# EAGLE design revD (EAGLE 9.2.2)

## Sheet 1 of 2
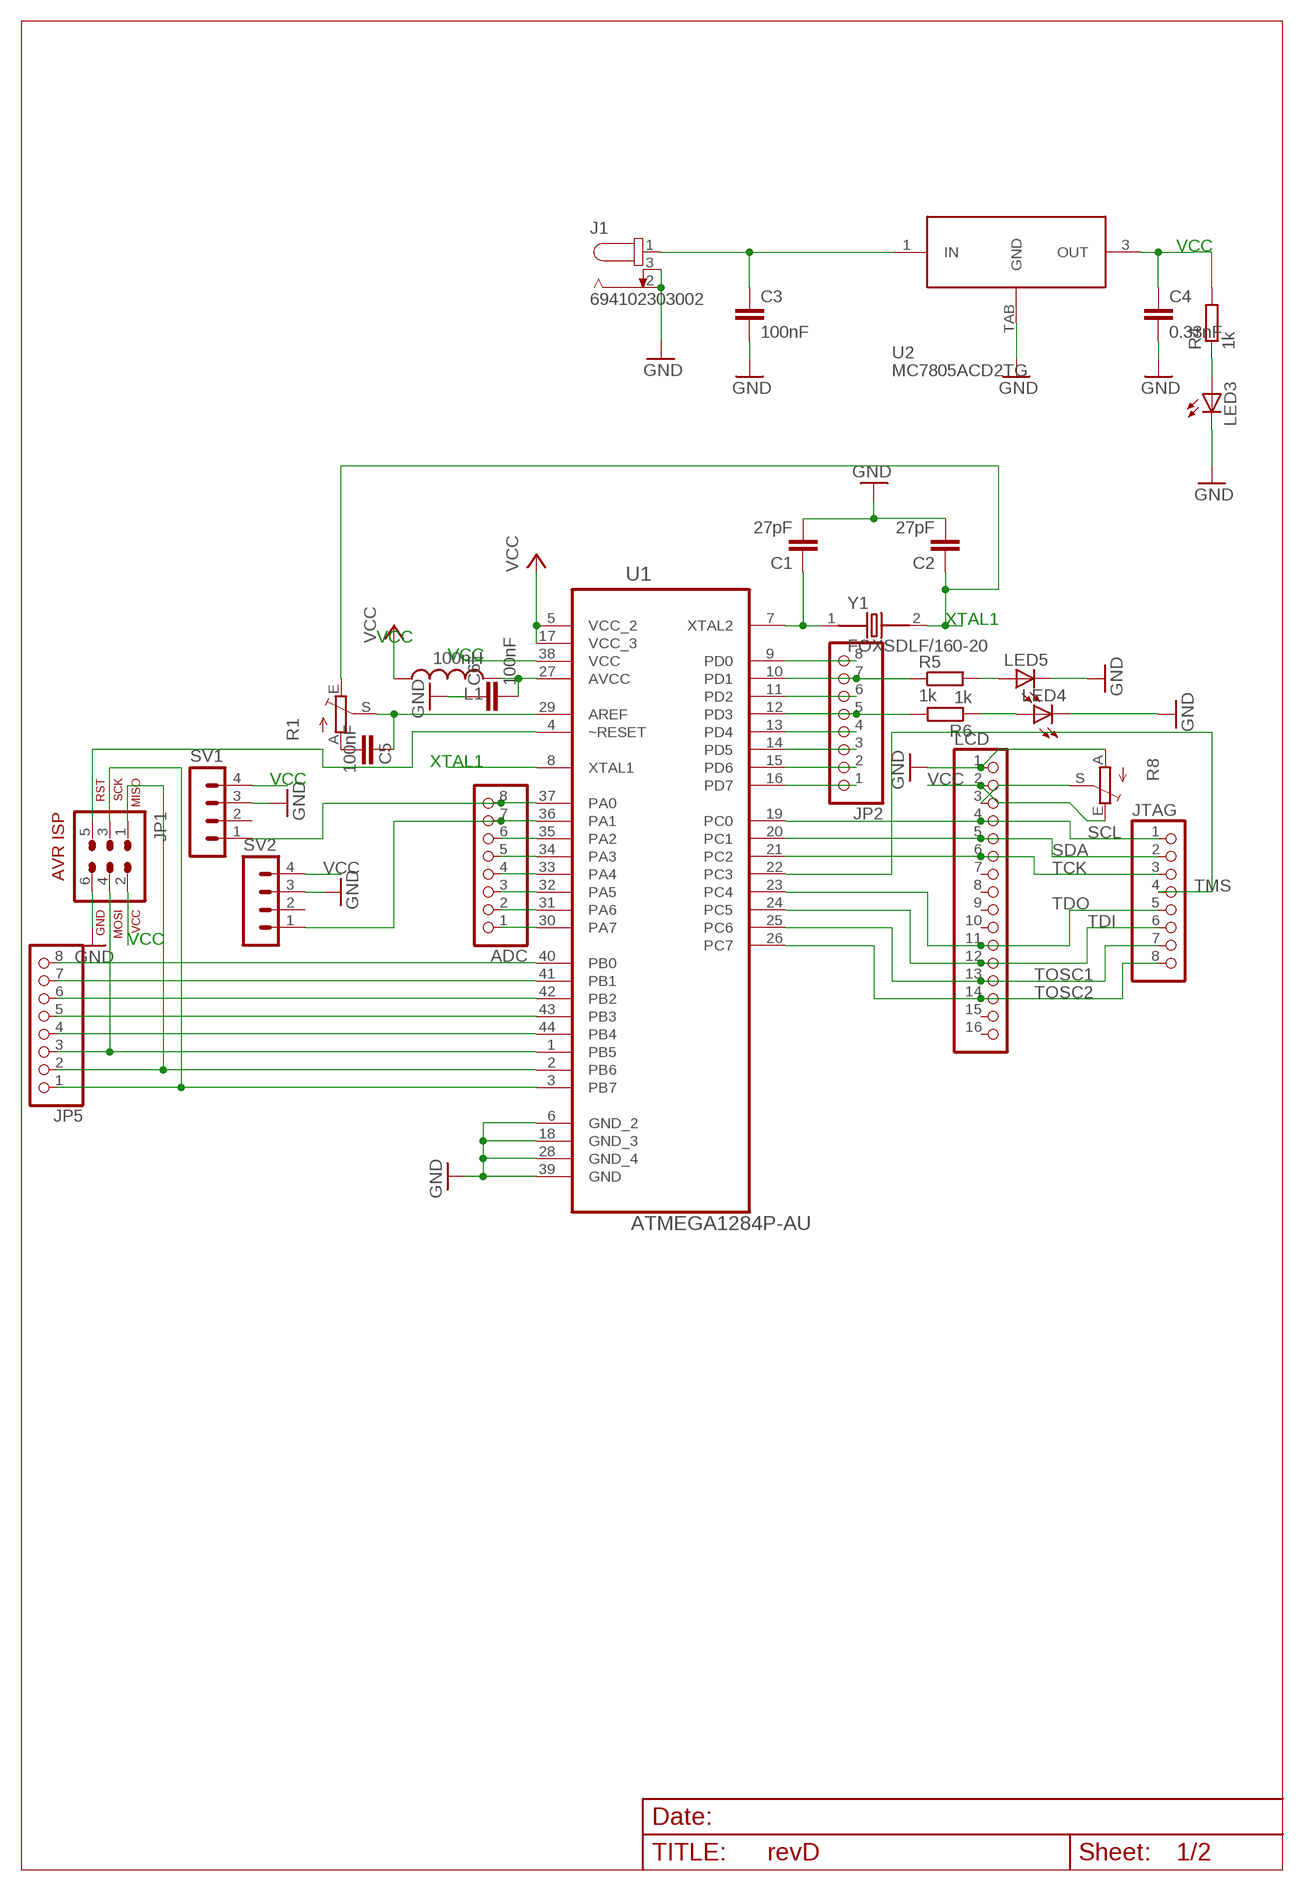
[diagram p0: schematic, sheet 1]

### Parts
ADC  PINHD-1X8  [1X08]
C1  27pF  C-EUC1206  [C1206]
C2  27pF  C-EUC1206  [C1206]
C3  100nF  C-EUC1206  [C1206]
C4  0.33nF  C-EUC1206  [C1206]
C5  100nF  C-EUC1206  [C1206]
C6  100nF  C-EUC1206  [C1206]
J1  694102303002  [69410X303002]
JP1  AVR-ISP-6VERT  [AVR-ISP-6]
JP2  PINHD-1X8  [1X08]
JP5  PINHD-1X8  [1X08]
JTAG  PINHD-1X8  [1X08]
L1  100nH  L-USL1812  [L1812]
LCD  PINHD-1X16  [1X16]
LED3  LED3MM  [LED3MM]
LED4  LED3MM  [LED3MM]
LED5  LED3MM  [LED3MM]
R1  TRIM_1234-S64YW  [S64YW]
R4  1k  R-EU_M1206  [M1206]
R5  1k  R-EU_M1206  [M1206]
R6  1k  R-EU_M1206  [M1206]
R8  TRIM_1234-S64YW  [S64YW]
SV1  MA04-1  [MA04-1]
SV2  MA04-1  [MA04-1]
U1  ATMEGA1284P-AU  [QFP80P1200X1200X120-44N]
U2  MC7805ACD2TG  [D2PAK]
Y1  FOXSDLF/160-20  [XTAL_FOXSDLF/160-20]

### Nets
GND: C1.2 C2.2 C3.2 C4.2 C6.1 J1.2 J1.3 JP1.6 LCD.1 LED3.K(C) LED4.K(C) LED5.K(C) R8.A SV1.3 SV2.3 U1.6(GND_2) U1.18(GND_3) U1.28(GND_4) U1.39(GND) U2.TAB(GND) ; also sheet 2
N$1: C1.1 U1.7(XTAL2) Y1.1
N$2: C5.1 R1.S U1.29(AREF)
N$3: C5.2 R1.A
N$4: C6.2 L1.2 U1.27(AVCC)
N$5: C3.1 J1.1 U2.1(IN)
N$6: LED3.A R4.1
N$7: LED4.A R6.1
N$8: LED5.A R5.2
N$9: LCD.3 R8.S
N$13: JP5.8 U1.40(PB0)
N$14: JP5.7 U1.41(PB1)
N$15: JP5.6 U1.42(PB2)
N$16: JP5.5 U1.43(PB3)
N$17: JP5.4 U1.44(PB4)
N$18: JP1.4 JP5.3 U1.1(PB5)
N$19: JP1.1 JP5.2 U1.2(PB6)
N$20: JP1.3 JP5.1 U1.3(PB7)
N$21: ADC.8 SV1.1 U1.37(PA0)
N$22: ADC.7 SV2.1 U1.36(PA1)
N$23: ADC.6 U1.35(PA2)
N$24: ADC.5 U1.34(PA3)
N$25: ADC.4 U1.33(PA4)
N$26: ADC.3 U1.32(PA5)
N$27: ADC.2 U1.31(PA6)
N$28: ADC.1 U1.30(PA7)
N$29: JP2.8 U1.9(PD0)
N$30: JP2.7 R5.1 U1.10(PD1)
N$31: JP2.6 U1.11(PD2)
N$32: JP2.5 R6.2 U1.12(PD3)
N$33: JP2.4 U1.13(PD4)
N$34: JP2.3 U1.14(PD5)
N$35: JP2.2 U1.15(PD6)
N$36: JP2.1 U1.16(PD7)
N$37: JP1.5 U1.4(~RESET)
SCL: JTAG.1 LCD.4 U1.19(PC0)
SDA: JTAG.2 LCD.5 U1.20(PC1)
TCK: JTAG.3 LCD.6 U1.21(PC2)
TDI: JTAG.6 LCD.12 U1.24(PC5)
TDO: JTAG.5 LCD.11 U1.23(PC4)
TMS: JTAG.4 U1.22(PC3)
TOSC1: JTAG.7 LCD.13 U1.25(PC6)
TOSC2: JTAG.8 LCD.14 U1.26(PC7)
VCC: C4.1 JP1.2 L1.1 LCD.2 R4.2 R8.E SV1.4 SV2.4 U1.5(VCC_2) U1.17(VCC_3) U1.38(VCC) U2.3(OUT) ; also sheet 2
XTAL1: C2.1 R1.E U1.8(XTAL1) Y1.2
Unconnected: LCD.7 LCD.8 LCD.9 LCD.10 LCD.15 LCD.16 R1.S@1(S) R8.S@1(S) SV1.2 SV2.2

## Sheet 2 of 2
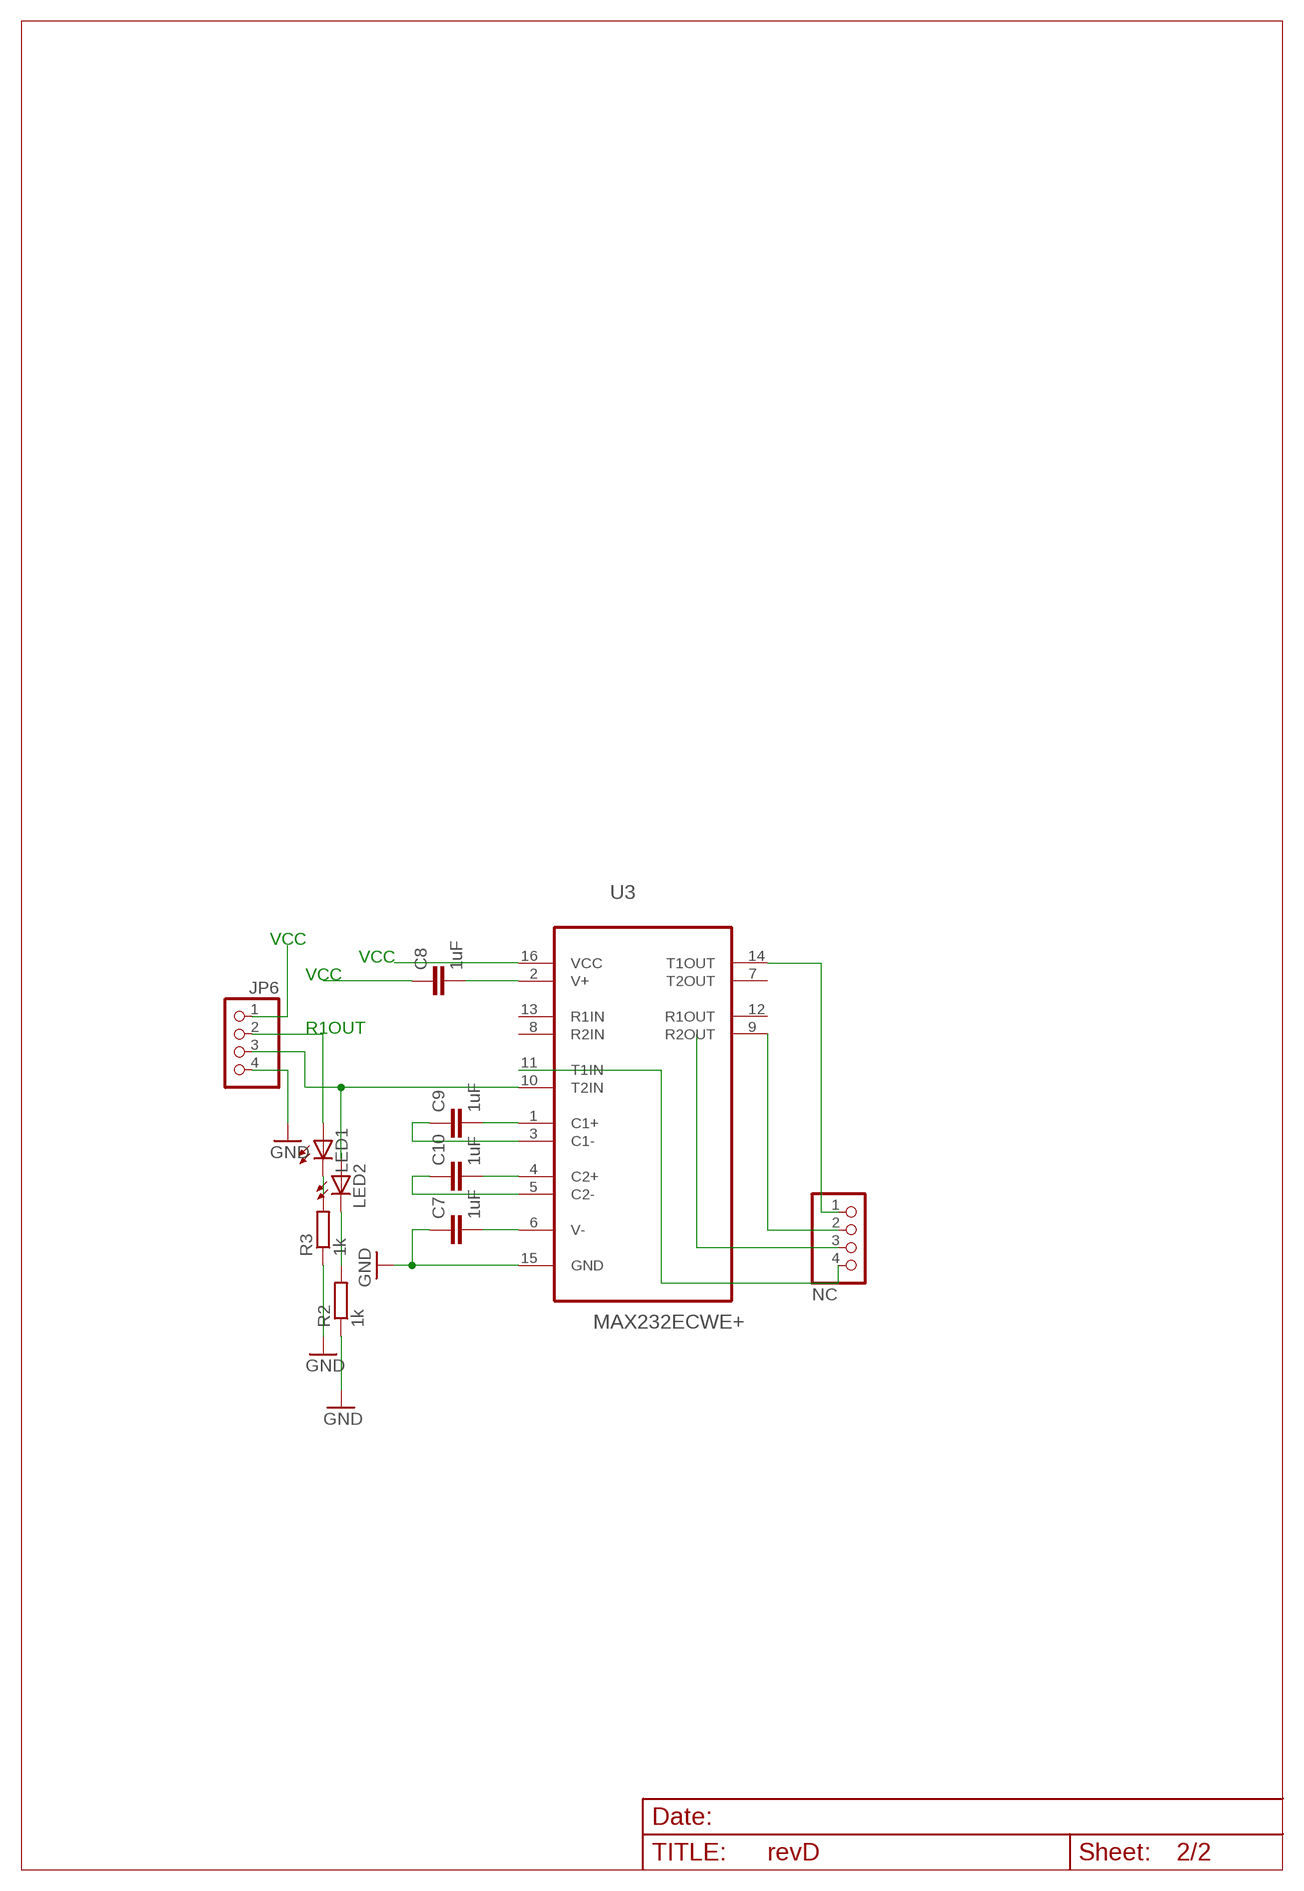
[diagram p1: schematic, sheet 2]

### Parts
C7  1uF  C-EUC1206  [C1206]
C8  1uF  C-EUC1206  [C1206]
C9  1uF  C-EUC1206  [C1206]
C10  1uF  C-EUC1206  [C1206]
JP6  PINHD-1X4  [1X04]
LED1  LEDSMT1206  [1206]
LED2  LEDSMT1206  [1206]
NC  NC  PINHD-1X4  [1X04]
R2  1k  R-EU_R1206  [R1206]
R3  1k  R-EU_R1206  [R1206]
U3  MAX232ECWE+  [SOIC127P1032X265-16N]

### Nets
GND: C7.1 JP6.4 R2.1 R3.1 U3.15(GND) ; also sheet 1
N$38: C8.2 U3.2(V+)
N$39: C7.2 U3.6(V-)
N$40: C10.2 U3.4(C2+)
N$41: C10.1 U3.5(C2-)
N$42: C9.2 U3.1(C1+)
N$43: C9.1 U3.3(C1-)
N$44: JP6.3 LED2.A U3.10(T2IN)
N$45: LED1.C R3.2
N$46: LED2.C R2.2
N$58: NC.1 U3.14(T1OUT)
N$59: NC.2 U3.9(R2OUT)
N$60: NC.4 U3.11(T1IN)
N$61: NC.3
R1OUT: JP6.2 LED1.A
VCC: C8.1 JP6.1 U3.16(VCC) ; also sheet 1
Unconnected: U3.7(T2OUT) U3.8(R2IN) U3.12(R1OUT) U3.13(R1IN)

## Library data of the parts
ADC JP2 JP5 JTAG = pinhead:PINHD-1X8: PIN HEADER
C1-C10 = rcl:C-EU: CAPACITOR, European symbol; SPICEPREFIX: C
J1 = 694102303002:694102303002: WR-DC_DC Power Jack_Right Angled_THT Center Pin Ø1.0_Plug ID Ø1.05_Plug OD Ø3.5 ;=>Code : Con_WR-DC_THT_6941xx303002_694102303002 <http://katalog.we-online.de/media/images/eican/Con_WR-DC_THT_6941xx303002_pf2.jpg> Details see: http://katalog.we-online.de/em/datasheet/6941xx303002.pdf Created 2014-10-08, Karrer Zheng 2014 (C) Wurth Elektronik; AVAILABILITY: Unavailable; DESCRIPTION: DC Power jack [Würth Elektronik] 694102303002 DC Power jack; MF: Wurth Electronics; MP: 694102303002; PACKAGE: None; PRICE: None
JP1 = avr-7:AVR-ISP-6: AVR ISP-6 Serial Programming Header
JP6 NC = pinhead:PINHD-1X4: PIN HEADER
L1 = rcl:L-US: INDUCTOR, American symbol; SPICEPREFIX: L
LCD = pinhead:PINHD-1X16: PIN HEADER
LED1-LED5 = led:LED: LED OSRAM: - CHIPLED LG R971, LG N971, LY N971, LG Q971, LY Q971, LO R971, LY R971 LH N974, LH R974 LS Q976, LO Q976, LY Q976 LO Q996 - Hyper CHIPLED LW Q18S LB Q993, LB Q99A, LB R99A - SideLED LS A670, LO A670, LY A670, LG A670, LP A670 LB A673, LV A673, LT A673, LW A673 LH A674 LY A675 LS A676, LA A676, LO A676, LY A676, LW A676 LS A679, LY A679, LG A679 - Hyper Micro SIDELED® LS Y876, LA Y876, LO Y876, LY Y876 LT Y87S - SmartLED LW L88C, LW L88S LB L89C, LB L89S, LG L890 LS L89K, LO L89K, LY L89K LS L896, LA L896, LO L896, LY L896 - TOPLED LS T670, LO T670, LY T670, LG T670, LP T670 LSG T670, LSP T670, LSY T670, LOP T670, LYG T670 LG T671, LOG T671, LSG T671 LB T673, LV T673, LT T673, LW T673 LH T674 LS T676, LA T676, LO T676, LY T676, LB T676, LH T676, LSB T676, LW T676 LB T67C, LV T67C, LT T67C, LS T67K, LO T67K, LY T67K, LW E67C LS E67B, LA E67B, LO E67B, LY E67B, LB E67C, LV E67C, LT E67C LW T67C LS T679, LY T679, LG T679 LS T770, LO T770, LY T770, LG T770, LP T770 LB T773, LV T773, LT T773, LW T773 LH T774 LS E675, LA E675, LY E675, LS T675 LS T776, LA T776, LO T776, LY T776, LB T776 LHGB T686 LT T68C, LB T68C - Hyper Mini TOPLED® LB M676 - Mini TOPLED Santana® LG M470 LS M47K, LO M47K, LY M47K Source: http://www.osram.convergy.de LUXEON: - LUMILED® LXK2-PW12-R00, LXK2-PW12-S00, LXK2-PW14-U00, LXK2-PW14-V00 LXK2-PM12-R00, LXK2-PM12-S00, LXK2-PM14-U00 LXK2-PE12-Q00, LXK2-PE12-R00, LXK2-PE12-S00, LXK2-PE14-T00, LXK2-PE14-U00 LXK2-PB12-K00, LXK2-PB12-L00, LXK2-PB12-M00, LXK2-PB14-N00, LXK2-PB14-P00, LXK2-PB14-Q00 LXK2-PR12-L00, LXK2-PR12-M00, LXK2-PR14-Q00, LXK2-PR14-R00 LXK2-PD12-Q00, LXK2-PD12-R00, LXK2-PD12-S00 LXK2-PH12-R00, LXK2-PH12-S00 LXK2-PL12-P00, LXK2-PL12-Q00, LXK2-PL12-R00 Source: www.luxeon.com KINGBRIGHT: KA-3528ASYC Source: www.kingbright.com
R1 R8 = pot:TRIM_1234-: POTENTIOMETER
R2-R6 = rcl:R-EU_: RESISTOR, European symbol; SPICEPREFIX: R
SV1 SV2 = con-lstb:MA04-1: PIN HEADER; OC_FARNELL: unknown; OC_NEWARK: unknown
U1 = ATMEGA1284P-AU:ATMEGA1284P-AU: Microcontroller with Programmable Flash; AVAILABILITY: Unavailable; DESCRIPTION: MCU 8-Bit ATmega AVR RISC 128KB Flash 2.5V/3.3V/5V 44-Pin TQFP; MF: Microchip; MP: ATMEGA1284P-AU; PACKAGE: TQFP-44 Microchip; PRICE: None
U2 = MC7805ACD2TG:MC7805ACD2TG: http://octopart.com/mc7805acd2tg.-on+semiconductor-11809125; AVAILABILITY: Unavailable; DESCRIPTION: Linear Voltage Regulator, Positive, 5.0 V, 1.0 A Vout: 5.0 V; TJ = 0°C to +125°C; MF: ON Semiconductor; MP: MC7805ACD2TG; PACKAGE: D2PAK ON Semiconductor; PRICE: None
U3 = MAX232ECWE_:MAX232ECWE+: +5V-Powered, Multichannel RS-232 Drivers/Receivers; AVAILABILITY: Unavailable; DESCRIPTION: Dual Transmitter/Receiver RS-232 16-Pin SOIC W; MF: Maxim Integrated; MP: MAX232ECWE+; PACKAGE: SOIC-16 Maxim Integrated; PRICE: None
Y1 = FOXSDLF_160-20:FOXSDLF/160-20: Crystal 16MHz 20pF 2-Pin HC-49/SD; AVAILABILITY: Unavailable; DESCRIPTION: Crystal 16MHz 20pF 2-Pin HC-49/SD; MF: Fox; MP: FOXSDLF/160-20; PACKAGE: HC49/US Fox; PRICE: None

## Board
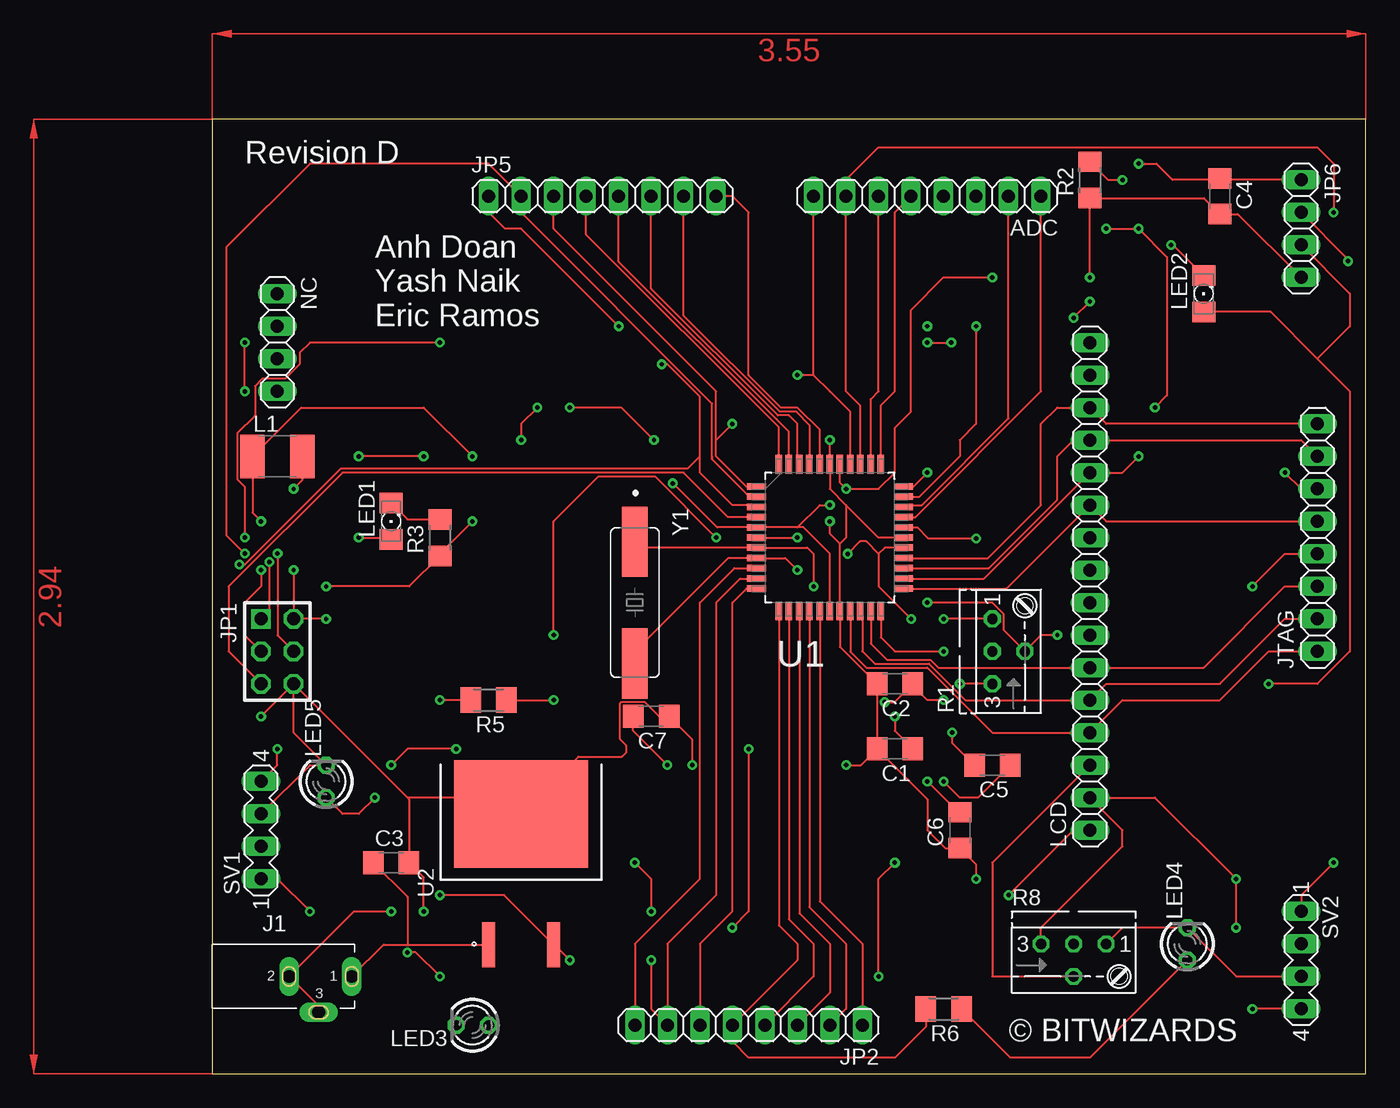
[diagram p2: board, top side]
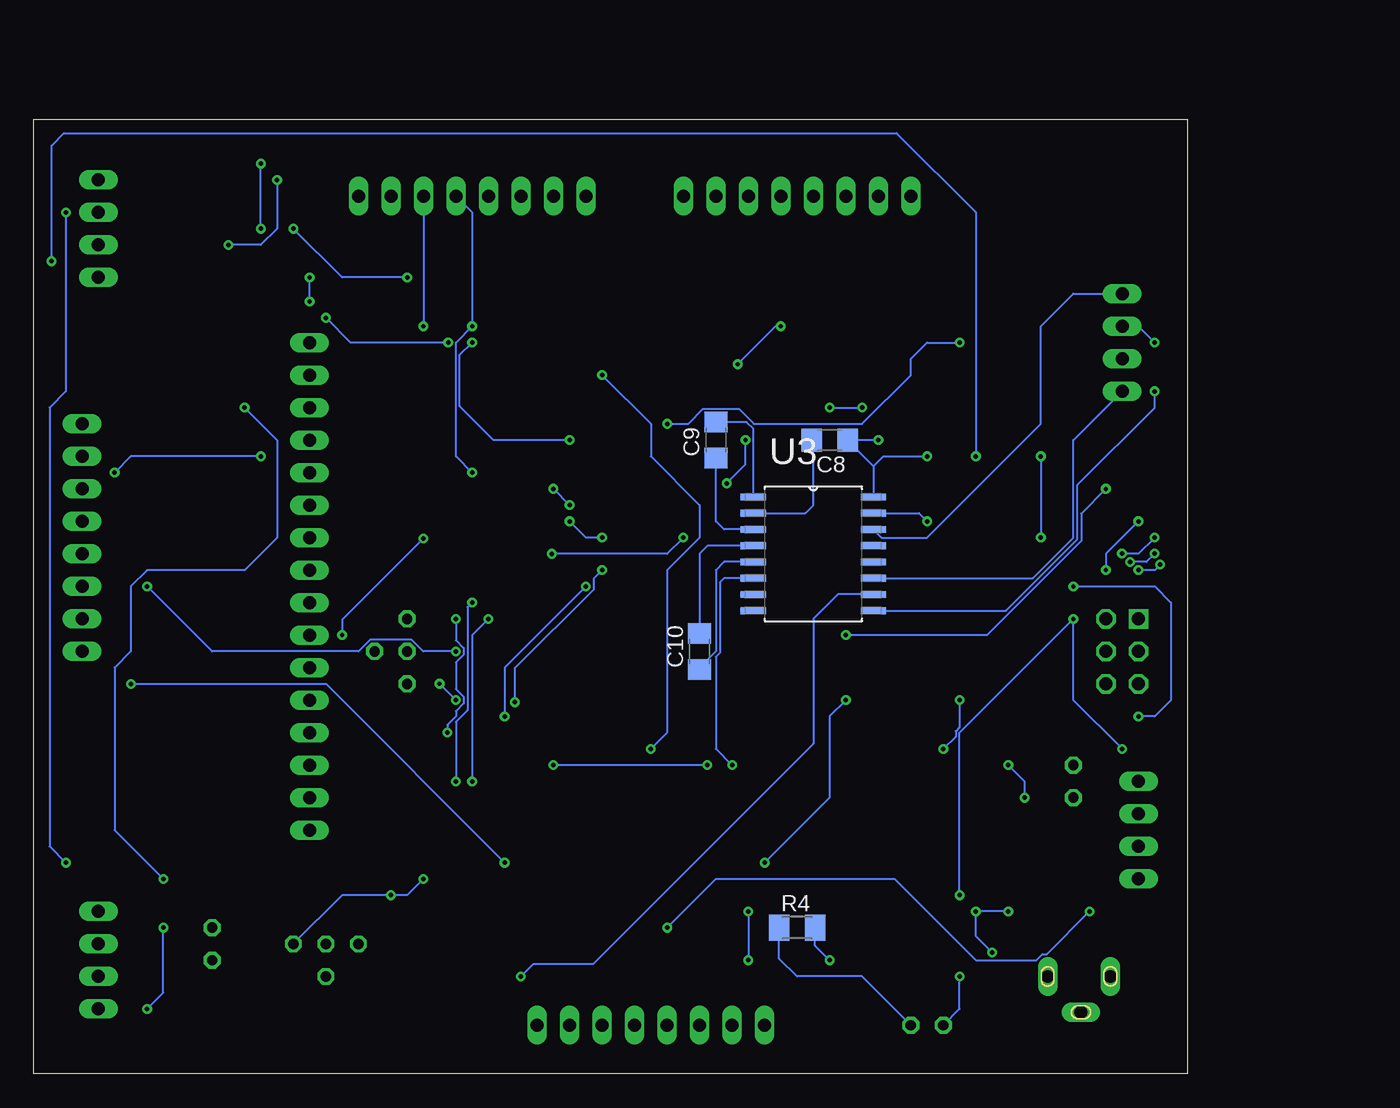
[diagram p3: board, bottom side, seen from below]

Size 90.15 x 74.6 mm. Coordinates in mm from the lower left corner, seen from the top.
Outline: 0,0 90.15,0 90.15,74.6 0,74.6 0,0
Copper layers (1*16): Top 0.035mm / dielectric 1.5mm / Bottom 0.035mm
Design rules "default": minimum track width 6mil, minimum drill 0.35mm, track to track 6mil, track to pad 6mil, pad to pad 6mil, via to via 6mil, smd to smd 6mil, copper to edge 40mil, drill to drill 6mil, minimum pad ring 10mil, minimum via ring 8mil, stop-mask expansion 4mil, vias tented up to drill 0mil, thermal gap 10mil

### Footprints (pad centres in the part's own frame; a part is rotated, then mirrored left to right if it is on the bottom)
1X08 = drill 1.016 long: 1 -8.89,0; 2 -6.35,0; 3 -3.81,0; 4 -1.27,0; 5 1.27,0; 6 3.81,0; 7 6.35,0; 8 8.89,0
C1206 = smd 1.6 x 1.8: 1 -1.4,0; 2 1.4,0
69410X303002 = drill 1 pad 1.5 long: 1 10.9,0; 2 6,0; 3 8.3,-2.8
AVR-ISP-6 = drill 1.016 square: 1 -2.54,-1.27 | drill 1.016 octagon: 2 -2.54,1.27; 3 0,-1.27; 4 0,1.27; 5 2.54,-1.27; 6 2.54,1.27
1X04 = drill 1.016 long: 1 -3.81,0; 2 -1.27,0; 3 1.27,0; 4 3.81,0
L1812 = smd 1.9 x 3.4: 1 -1.95,0; 2 1.95,0
1X16 = drill 1.016 long: 1 -19.05,0; 2 -16.51,0; 3 -13.97,0; 4 -11.43,0; 5 -8.89,0; 6 -6.35,0; 7 -3.81,0; 8 -1.27,0; 9 1.27,0; 10 3.81,0; 11 6.35,0; 12 8.89,0; 13 11.43,0; 14 13.97,0; 15 16.51,0; 16 19.05,0
1206 = smd 1.6 x 1.803: A -1.422,0; C 1.422,0
LED3MM = drill 0.813 octagon: A -1.27,0; K 1.27,0
S64YW = drill 0.813 octagon: A 2.54,1.27; E -2.54,1.27; S 0,-1.27; S@1 0,1.27
R1206 = smd 1.6 x 1.803: 1 -1.422,0; 2 1.422,0
M1206 = smd 1.6 x 2: 1 -1.4,0; 2 1.4,0
MA04-1 = drill 1.016 long: 1 -3.81,0; 2 -1.27,0; 3 1.27,0; 4 3.81,0
QFP80P1200X1200X120-44N = smd 1.473 x 0.508: 1 -5.74,3.988; 2 -5.74,3.2; 3 -5.74,2.388; 4 -5.74,1.6; 5 -5.74,0.787; 6 -5.74,0; 7 -5.74,-0.787; 8 -5.74,-1.6; 9 -5.74,-2.388; 10 -5.74,-3.2; 11 -5.74,-3.988; 23 5.74,-3.988; 24 5.74,-3.2; 25 5.74,-2.388; 26 5.74,-1.6; 27 5.74,-0.787; 28 5.74,0; 29 5.74,0.787; 30 5.74,1.6; 31 5.74,2.388; 32 5.74,3.2; 33 5.74,3.988 | smd 0.508 x 1.473: 12 -3.988,-5.74; 13 -3.2,-5.74; 14 -2.388,-5.74; 15 -1.6,-5.74; 16 -0.787,-5.74; 17 0,-5.74; 18 0.787,-5.74; 19 1.6,-5.74; 20 2.388,-5.74; 21 3.2,-5.74; 22 3.988,-5.74; 34 3.988,5.74; 35 3.2,5.74; 36 2.388,5.74; 37 1.6,5.74; 38 0.787,5.74; 39 0,5.74; 40 -0.787,5.74; 41 -1.6,5.74; 42 -2.388,5.74; 43 -3.2,5.74; 44 -3.988,5.74
D2PAK = smd 3.504 x 1.016: 1 -3.863,2.54; 3 -3.863,-2.54 | smd 8.38 x 10.49: TAB 6.35,0
SOIC127P1032X265-16N = smd 1.981 x 0.533: 1 -4.699,4.445; 2 -4.699,3.175; 3 -4.699,1.905; 4 -4.699,0.635; 5 -4.699,-0.635; 6 -4.699,-1.905; 7 -4.699,-3.175; 8 -4.699,-4.445; 9 4.699,-4.445; 10 4.699,-3.175; 11 4.699,-1.905; 12 4.699,-0.635; 13 4.699,0.635; 14 4.699,1.905; 15 4.699,3.175; 16 4.699,4.445
XTAL_FOXSDLF/160-20 = smd 5.5 x 2: 1 -4.75,0; 2 4.75,0

### Placement (x,y rotation side)
ADC  55.88,68.58 180 top
C1  53.34,25.4 180 top
C2  53.34,30.48 180 top
C3  13.97,16.51 0 top
C4  78.74,68.58 270 top
C5  60.96,24.13 180 top
C6  58.42,19.05 90 top
C7  34.29,27.94 180 top
C8  27.94,49.53 180 bottom
C9  36.83,49.53 90 bottom
C10  38.1,33.02 90 bottom
J1  0,7.62 0 top
JP1  5.08,33.02 270 top
JP2  41.91,3.81 180 top
JP5  30.48,68.58 0 top
JP6  85.09,66.04 270 top
JTAG  86.36,41.91 90 top
L1  5.08,48.26 0 top
LCD  68.58,38.1 90 top
LED1  13.97,43.18 90 top
LED2  77.47,60.96 90 top
LED3  20.32,3.81 180 top
LED4  76.2,10.16 90 top
LED5  8.89,22.86 90 top
NC  5.08,57.15 270 top
R1  62.23,33.02 90 top
R2  68.58,69.85 90 top
R3  17.78,41.91 90 top
R4  30.48,11.43 0 bottom
R5  21.59,29.21 180 top
R6  57.15,5.08 180 top
R8  67.31,8.89 0 top
SV1  3.81,19.05 90 top
SV2  85.09,8.89 270 top
U1  48.26,41.91 0 top
U2  24.13,13.97 90 top
U3  29.21,40.64 0 bottom
Y1  33.02,36.83 270 top

### Tracks (layer width: path | path; a pad name or v marks a point on that pad's centre or on a via)
GND  (via drill 0.35)
  Top 0.152: 49.05,41.43 U1.18 49.05,33.37 C2.2 C1.2 | 49.53,44.45 48.26,45.72 U1.39 v48.26,49.53 | U1.6 v45.72,41.91 | J1.3 8.3,5.32 J1.2 11.08,12.7 v13.97,12.7 | v16.51,12.7 16.51,15.37 C3.2 15.37,21.46 15.24,21.59 | JP1.6 15.24,21.59 | 15.24,21.59 22.86,21.59 U2.TAB 28.6,24.79 32,24.79 32.36,25.15 32.36,25.65 31.86,26.15 31.86,28.93 32,29.07 33.78,29.07 34.91,27.94 C7.1 37.49,26.14 v37.49,24.13 | v20.32,43.18 17.78,40.64 R3.1 15.39,38.1 v8.89,38.1 | v59.69,15.24 59.69,16.38 C6.1 57.28,17.65 55.88,19.05 55.88,21.46 C1.2 | JP6.4 80.14,67.18 C4.2 77.49,68.43 R2.1 v68.58,62.23 | v3.81,27.94 JP1.6 | v49.53,24.13 50.67,24.13 C1.2 | v55.88,57.15 v57.76,57.15 | v67.31,59.08 v68.58,60.35 | 49.05,41.43 48.26,42.22 v48.26,43.18 | 49.05,41.43 49.53,41.91 49.53,44.45 | U1.28 52.07,41.91 49.53,44.45 | SV2.3 80.01,7.62 LED4.K 71.12,11.43 R8.A | v17.78,7.62 15.9,9.5 v15.24,9.5 | JP1.6 6.35,26.67 LED5.K 7.62,24.13 SV1.3 | v62.23,13.97 67.31,19.05 LCD.1
  Bottom 0.152: v45.72,41.91 46.99,41.91 v48.26,43.18 | v13.97,12.7 v16.51,12.7 16.51,10.77 v15.24,9.5 | U3.15 20.95,43.81 v20.32,43.18 | v59.69,15.24 60.96,13.97 v62.23,13.97 66.04,13.97 R8.A | v8.89,38.1 2.54,38.1 1.27,36.83 1.27,29.21 2.54,27.94 v3.81,27.94 | v37.49,24.13 v49.53,24.13 | v48.26,49.53 54.2,49.53 56.84,52.18 56.84,56.19 v55.88,57.15 | v57.76,57.15 65.38,57.15 v67.31,59.08 | v68.58,60.35 v68.58,62.23 | LED3.K 17.78,5.08 v17.78,7.62
N$1  (via drill 0.35)
  Top 0.152: Y1.1 33.48,41.12 U1.7 46.51,41.12 46.99,40.64 v46.99,38.1 | v53.34,27.94 53.34,26.8 C1.1
  Bottom 0.152: v46.99,38.1 53.34,31.75 v53.34,27.94
N$2  (via drill 0.35)
  Top 0.152: U1.29 55.09,42.7 55.94,41.85 v59.69,41.85 | v66.04,34.29 64.77,34.29 R1.S 61.85,34.67 61.85,35.93 60.95,36.83 v55.88,36.83 | v57.15,22.86 58.42,21.59 59.69,21.59 59.82,21.59 C5.1
  Bottom 0.152: v59.69,41.85 66.04,35.5 v66.04,34.29 | v57.15,22.86 57.15,27.51 56.24,28.42 56.24,36.47 v55.88,36.83
N$3  (via drill 0.35)
  Top 0.152: R1.A v57.15,35.56 | v57.81,26.67 57.81,25.88 C5.2
  Bottom 0.152: v57.15,35.56 57.15,33.88 56.54,33.27 56.54,32.77 57.15,32.16 57.15,30.07 56.54,29.46 56.54,28.96 57.15,28.35 57.15,27.94 57.81,27.28 v57.81,26.67
N$4  (via drill 0.35)
  Top 0.152: v54.61,35.56 52.07,38.1 52.07,40.64 | v55.88,22.86 58.29,20.45 C6.2 | L1.2 7.03,46.4 v6.35,45.72 | v26.67,34.29 26.67,43.18 30.18,46.69 34.59,46.69 v39.37,41.91 | U1.27 52.55,41.12 52.07,40.64 | 52.07,40.64 51.1,41.6 50.62,41.6 v49.65,40.64
  Bottom 0.152: v54.61,35.56 55.88,34.29 v55.88,22.86 | v6.35,45.72 8.28,43.79 8.28,41.66 15.65,34.29 v26.67,34.29 | v39.37,41.91 40.64,40.64 v49.65,40.64
N$5
  Top 0.152: J1.1 13.39,10.11 15.24,10.11 | 15.24,10.11 U2.1 | C3.1 15.24,13.84 15.24,10.11
N$6
  Bottom 0.152: LED3.A 25.4,7.62 30.48,7.62 31.88,9.02 R4.1
N$7
  Top 0.152: LED4.A 68.58,1.27 62.36,1.27 R6.1
N$8  (via drill 0.35)
  Top 0.152: R5.2 v17.78,29.21 | v19.05,25.4 15.24,25.4 v13.97,24.13 | v12.7,21.59 11.43,20.32 10.16,20.32 LED5.A
  Bottom 0.152: v17.78,29.21 17.78,27.1 18.09,26.8 18.09,26.36 v19.05,25.4 | v13.97,24.13 12.7,22.86 v12.7,21.59
N$9
  Top 0.152: LCD.3 60.96,16.51 60.96,7.62 R8.S
N$13
  Top 0.152: U1.40 47.47,50.32 45.72,52.07 44.45,52.07 41.91,54.61 41.91,67.31 40.64,68.58 JP5.8
N$14
  Top 0.152: JP5.7 36.83,59.26 44.32,51.77 45.59,51.77 46.66,50.7 U1.41
N$15
  Top 0.152: U1.42 45.72,47.8 45.72,50.8 45.06,51.46 44.2,51.46 34.29,61.37 JP5.6
N$16
  Top 0.152: U1.43 45.06,50.19 44.09,51.16 44.07,51.16 31.75,63.48 JP5.5
N$17
  Top 0.152: U1.44 44.27,50.52 29.21,65.59 JP5.4
N$18  (via drill 0.35)
  Top 0.152: U1.1 41.73,45.9 39.37,48.26 | 39.37,48.26 39.37,53.34 26.67,66.04 JP5.3 | 39.37,48.26 39.37,49.53 v40.64,50.8 | v17.78,57.15 7.62,57.15 6.83,56.36 6.83,55.47 5.69,54.33 3.91,54.33 3.33,53.75 3.33,51.43 1.95,50.05 1.95,46.47 2.54,45.88 v2.54,41.91 | v5.09,40.66 5.09,34.27 JP1.4
  Bottom 0.152: v40.64,50.8 38.98,50.8 37.83,51.96 35.02,51.96 33.86,50.8 25.4,50.8 21.59,54.61 21.59,55.88 20.32,57.15 v17.78,57.15 | v2.54,41.91 3.79,40.66 v5.09,40.66
N$19  (via drill 0.35)
  Top 0.152: 39.06,48.04 39.06,48.26 | 39.06,48.26 39.06,52.38 24.13,67.31 JP5.2 21.59,71.12 7.62,71.12 1.09,64.59 1.09,42.1 v2.54,40.66 | v4.45,40.01 4.45,36.2 JP1.1 | 39.06,48.26 39.06,48.04 | 39.06,48.04 41.99,45.11 U1.2
  Bottom 0.152: v2.54,40.66 3.18,40.01 v4.45,40.01
N$20  (via drill 0.35)
  Top 0.152: 38.1,48.26 38.1,52.91 35.56,55.45 v35.13,55.45 | v31.75,58.42 24.13,66.04 22.86,66.04 21.59,67.31 JP5.1 | 38.1,48.26 37.13,47.3 10.03,47.3 2.54,39.8 v2.11,39.8 | v3.81,39.37 3.81,38.1 2.54,36.83 2.54,34.29 JP1.3 | U1.3 42.37,44.45 40.64,44.45 38.1,46.99 38.1,48.26
  Bottom 0.152: v35.13,55.45 32.16,58.42 v31.75,58.42 | v2.11,39.8 2.54,39.37 v3.81,39.37
N$21  (via drill 0.35)
  Top 0.152: U1.37 49.86,51.74 48.26,53.34 46.99,54.61 | 46.99,54.61 ADC.8 | 46.99,54.61 v45.72,54.61 | v41.91,25.4 41.91,12.7 v40.64,11.43 | v7.62,12.7 5.08,15.24 SV1.1
  Bottom 0.152: v45.72,54.61 41.91,50.8 41.91,48.26 38.1,44.45 38.1,41.91 40.64,39.37 40.64,26.67 v41.91,25.4 | v40.64,11.43 36.83,15.24 22.86,15.24 16.51,8.89 11.77,8.89 11.31,9.36 10.96,9.36 v7.62,12.7
N$22  (via drill 0.35)
  Top 0.152: U1.36 50.65,52.22 49.53,53.34 ADC.7 49.53,69.85 52.07,72.39 86.36,72.39 87.63,71.12 v87.63,67.31 | v87.63,16.51 85.09,13.97 SV2.1
  Bottom 0.152: v87.63,67.31 87.63,53.34 88.9,52.07 88.9,17.78 v87.63,16.51
N$23
  Top 0.152: U1.35 51.46,52.73 52.07,53.34 ADC.6
N$24
  Top 0.152: U1.34 52.25,52.25 53.34,53.34 53.34,67.31 ADC.5
N$25  (via drill 0.35)
  Top 0.152: U1.33 54.79,45.9 v55.88,46.99
  Bottom 0.152: v55.88,46.99 57.15,48.26 57.15,57.15 v55.88,58.42 55.88,67.31 ADC.4
N$26  (via drill 0.35)
  Top 0.152: U1.32 55.27,45.11 58.42,48.26 58.42,49.53 59.69,50.8 v59.69,58.42
  Bottom 0.152: ADC.3 v59.69,58.42
N$27
  Top 0.152: U1.31 54.15,44.45 55.45,44.45 62.23,51.23 ADC.2
N$28
  Top 0.152: U1.30 54.94,43.51 64.77,53.34 ADC.1
N$29
  Top 0.152: JP2.8 33.02,10.16 38.1,15.24 38.1,36.83 40.79,39.52 U1.9
N$30  (via drill 0.35)
  Top 0.152: U1.10 41.25,38.71 39.37,36.83 39.37,13.97 35.56,10.16 JP2.7 34.29,5.08 v34.29,8.89 | R5.1 v26.67,29.21 | v33.02,16.51 34.29,15.24 v34.29,12.7
  Bottom 0.152: v26.67,29.21 27.94,27.94 27.94,21.59 v33.02,16.51 | v34.29,12.7 v34.29,8.89
N$31
  Top 0.152: JP2.6 38.1,10.16 40.64,12.7 40.64,36.83 41.73,37.92 U1.11
N$32
  Top 0.152: U1.12 44.27,11.61 45.72,10.16 45.72,8.89 JP2.5 40.64,2.54 41.91,1.27 53.34,1.27 55.75,3.68 R6.2
N$33
  Top 0.152: U1.13 45.06,12.09 46.99,10.16 46.99,7.62 JP2.4
N$34
  Top 0.152: U1.14 45.87,12.55 48.26,10.16 48.26,6.35 JP2.3
N$35
  Top 0.152: U1.15 46.66,13.03 49.53,10.16 49.53,5.08 JP2.2
N$36
  Top 0.152: U1.16 47.47,13.49 50.8,10.16 JP2.1
N$37
  Top 0.152: JP1.5 1.27,33.02 1.27,38.1 10.16,46.99 36.83,46.99 40.31,43.51 U1.4
N$38
  Bottom 0.152: U3.2 29.84,43.81 29.21,44.45 29.21,49.53 C8.2
N$39  (via drill 0.35)
  Top 0.152: v35.56,24.13 32.89,26.8 C7.2
  Bottom 0.152: U3.6 36.2,38.73 36.52,38.41 36.52,32.89 36.83,32.59 36.83,25.4 v35.56,24.13
N$40
  Bottom 0.152: U3.4 37.47,41.27 38.1,40.64 C10.2
N$41
  Bottom 0.152: U3.5 36.2,40.01 36.83,39.37 36.83,33.02 38.1,31.75 C10.1
N$42
  Bottom 0.152: U3.1 33.91,50.42 34.42,50.93 C9.2
N$43
  Bottom 0.152: U3.3 36.2,42.55 36.83,43.18 C9.1
N$44  (via drill 0.35)
  Top 0.152: v52.07,7.62 52.07,15.24 v53.34,16.51 | LED2.A 82.7,59.54 86.36,55.88 | 86.36,55.88 88.9,53.34 88.9,33.02 86.36,30.48 v82.55,30.48 | JP6.3 88.9,60.96 88.9,58.42 86.36,55.88
  Bottom 0.152: U3.10 27.3,37.47 29.21,35.56 29.21,25.81 46.43,8.59 51.1,8.59 v52.07,7.62 | v53.34,16.51 67.31,30.48 v82.55,30.48
N$45
  Top 0.152: LED1.C 15.24,43.33 R3.2
N$46  (via drill 0.35)
  Top 0.152: R2.2 70,69.85 v71.12,69.85 | v74.93,64.77 75.08,64.77 LED2.C
  Bottom 0.152: v71.12,69.85 71.12,66.04 72.39,64.77 v74.93,64.77
N$58
  Bottom 0.152: NC.1 8.89,60.96 11.43,58.42 11.43,50.8 20.32,41.91 23.88,41.91 U3.14
N$59  (via drill 0.35)
  Top 0.152: v2.54,53.34 v2.54,57.15
  Bottom 0.152: U3.9 14.17,36.2 8.59,41.78 8.59,46.02 2.54,52.07 v2.54,53.34 | v2.54,57.15 3.81,58.42 NC.2
N$60
  Bottom 0.152: U3.11 12.06,38.73 8.89,41.91 8.89,49.53 NC.4
R1OUT  (via drill 0.35)
  Top 0.152: JP6.2 88.76,63.64 v88.76,63.5 | v16.51,48.26 v11.43,48.26 | v11.43,41.91 13.82,41.91 LED1.A
  Bottom 0.152: v88.76,63.5 88.76,72.53 87.78,73.51 22.71,73.51 16.51,67.31 v16.51,48.26 | v11.43,48.26 v11.43,41.91
SCL
  Top 0.152: U1.19 49.86,32.99 51.1,31.75 55.88,31.75 60.96,26.67 LCD.4 71.12,29.21 78.74,29.21 82.55,33.02 JTAG.1
SDA
  Top 0.152: U1.20 50.8,36.02 50.8,33.02 51.77,32.05 56.01,32.05 58.85,29.21 LCD.5 69.85,30.48 78.74,30.48 83.82,35.56 JTAG.2
TCK
  Top 0.152: U1.21 51.46,33.63 52.73,32.36 56.13,32.36 56.74,31.75 LCD.6 77.47,31.75 83.82,38.1 JTAG.3
TDI  (via drill 0.35)
  Top 0.152: U1.24 60.3,38.71 LCD.12 71.12,46.99 v72.39,48.26 | v83.82,46.99 85.09,45.72 JTAG.6
  Bottom 0.152: v72.39,48.26 82.55,48.26 v83.82,46.99
TDO
  Top 0.152: U1.23 62.05,37.92 LCD.11 69.85,43.18 JTAG.5
TMS  (via drill 0.35)
  Top 0.152: U1.22 52.25,34.11 53.34,33.02 v57.15,33.02 | v81.28,38.1 83.82,40.64 JTAG.4
  Bottom 0.152: v81.28,38.1 76.2,33.02 64.76,33.02 63.87,33.91 60.59,33.91 59.7,33.02 v57.15,33.02
TOSC1
  Top 0.152: U1.25 60.68,39.52 66.04,44.88 66.04,48.26 67.31,49.53 LCD.13 85.09,49.53 JTAG.7
TOSC2
  Top 0.152: U1.26 60.63,40.31 64.77,44.45 64.77,50.8 66.04,52.07 LCD.14 69.85,50.8 JTAG.8
VCC  (via drill 0.35)
  Top 0.152: U1.17 48.26,40.64 46.2,42.7 45.72,42.7 | 45.72,42.7 U1.5 39.44,42.7 v35.99,46.15 | v17.78,13.97 22.81,13.97 U2.3 26.72,10.11 v27.94,8.89 | v8.89,35.56 JP1.2 v6.35,39.37 | v3.81,43.18 3.13,43.86 L1.1 6.94,52.07 16.51,52.07 v20.32,48.26 | JP6.1 75.06,69.85 75,69.92 | C4.1 78.67,69.92 75,69.92 | v72.39,71.12 73.79,71.12 75,69.92 | v34.52,49.53 31.98,52.07 v27.94,52.07 | v25.4,52.07 24.13,50.8 v24.13,49.53 | 45.72,42.7 47.47,44.45 v48.26,44.45 | U1.38 49.05,46.2 v49.53,45.72 52.07,45.72 53.34,46.99 53.34,50.48 54.61,51.75 54.61,59.69 57.15,62.23 v60.96,62.23 | v69.85,66.04 v72.39,66.04 74.61,63.82 74.61,53.02 v73.66,52.07 | SV2.4 v81.28,5.08 | v80.01,11.43 v80.01,15.24 73.66,21.59 LCD.2 71.12,19.05 71.12,17.78 64.77,11.43 R8.E | SV1.4 5.08,24.13 v5.08,25.4
  Bottom 0.152: 24.51,47.5 C8.1 v24.13,49.53 | 24.51,47.5 U3.16 | v17.78,13.97 17.78,26.67 v8.89,35.56 8.89,29.21 v5.08,25.4 | v3.81,43.18 6.35,40.64 v6.35,39.37 | v72.39,66.04 v72.39,71.12 | 24.51,47.5 23.75,48.26 v20.32,48.26 | v35.99,46.15 34.52,47.62 v34.52,49.53 | v27.94,52.07 v25.4,52.07 | v48.26,44.45 v49.53,45.72 | v60.96,62.23 66.04,62.23 v69.85,66.04 | v73.66,52.07 71.12,49.53 71.12,41.91 73.66,39.37 81.28,39.37 82.55,38.1 82.55,33.02 83.82,31.75 83.82,19.05 v80.01,15.24 | v81.28,5.08 80.01,6.35 v80.01,11.43 | v27.94,8.89 29.08,10.03 R4.2
XTAL1  (via drill 0.35)
  Top 0.152: v45.72,39.37 44.78,40.31 U1.8 40.31,40.31 33.02,33.02 Y1.2 | v52.55,29.05 53.31,29.05 54.67,30.41 | 54.67,30.41 C2.1 | R1.E v58.44,30.48 v58.43,30.49 | v57.15,29.21 55.88,29.21 54.67,30.41
  Bottom 0.152: v45.72,39.37 46.38,38.71 46.38,37.85 52.55,31.68 v52.55,29.05 | v58.43,30.49 v57.15,29.21
(copper drawn outside any net)
  shapes: Top area x2

### Text on the board
tNames: Revision D | Anh Doan / Yash Naik / Eric Ramos | © BITWIZARDS